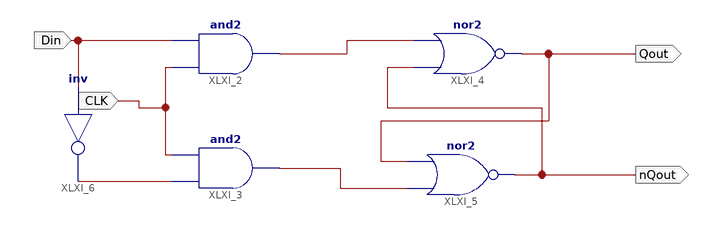
[diagram p0: schematic sheet 1]
// Xilinx ISE schematic Ex4.sch (spartan3e) as structural Verilog: 5 symbols, 4 ports
module Ex4 (
  input  CLK,
  input  Din,
  output nQout,
  output Qout
);

  wire XLXN_3, XLXN_4, XLXN_5;

  and XLXI_2 (XLXN_4, CLK, Din);
  and XLXI_3 (XLXN_5, XLXN_3, CLK);
  nor XLXI_4 (Qout, nQout, XLXN_4);
  nor XLXI_5 (nQout, XLXN_5, Qout);
  not XLXI_6 (XLXN_3, Din);
endmodule
